# EAGLE design Qwiic_Shield_for_Photon (EAGLE 7.7.0)
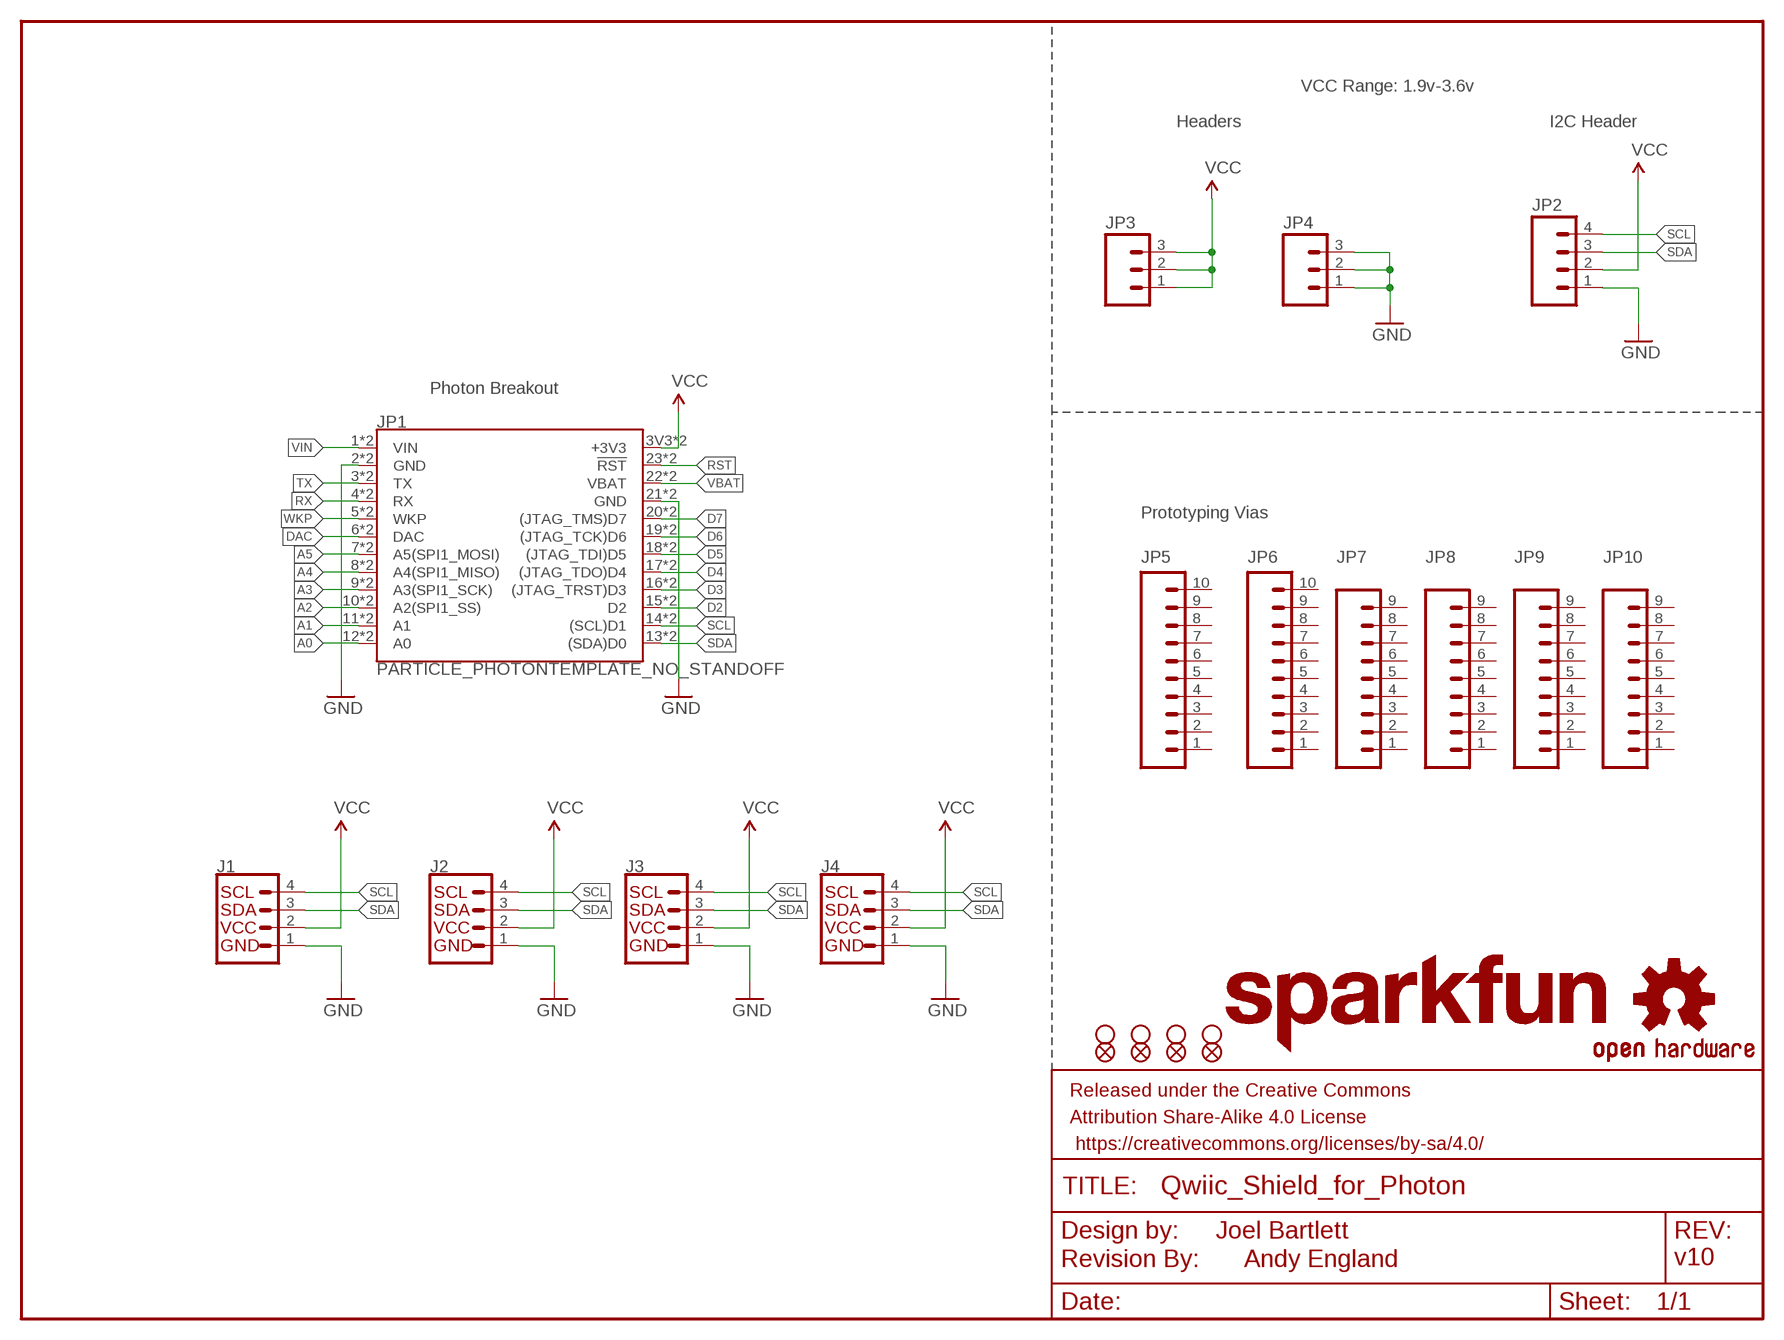
[diagram p0: schematic, sheet 1]

## Parts
FD1  FIDUCIALUFIDUCIAL  [FIDUCIAL-MICRO]
FD2  FIDUCIALUFIDUCIAL  [FIDUCIAL-MICRO]
FD3  FIDUCIALUFIDUCIAL  [FIDUCIAL-MICRO]
FD4  FIDUCIALUFIDUCIAL  [FIDUCIAL-MICRO]
FRAME1  FRAME-LETTER  [CREATIVE_COMMONS]
H1  STAND-OFF  [STAND-OFF]
H2  STAND-OFF  [STAND-OFF]
H3  STAND-OFF  [STAND-OFF]
H4  STAND-OFF  [STAND-OFF]
J1  QWIIC_CONNECTORJS-1MM  [1X04_1MM_RA]
J2  QWIIC_CONNECTORJS-1MM  [1X04_1MM_RA]
J3  QWIIC_CONNECTORJS-1MM  [1X04_1MM_RA]
J4  I2C_STANDARDJS-1MM  [1X04_1MM_RA]
JP1  PARTICLE_PHOTONTEMPLATE_NO_STANDOFF  [PARTICLE_PHOTON_TEMPLATE_NO_STANDOFF]
JP2  M04PTH  [1X04]
JP3  M03PTH  [1X03]
JP4  M03PTH  [1X03]
JP5  M10NO_SILK_PTH_FEMALE  [1X10_NO_SILK]
JP6  M10NO_SILK_PTH_FEMALE  [1X10_NO_SILK]
JP7  M09NO_SILK  [1X09_NO_SILK]
JP8  M09NO_SILK  [1X09_NO_SILK]
JP9  M09NO_SILK  [1X09_NO_SILK]
JP10  M09NO_SILK  [1X09_NO_SILK]
LOGO1  OSHW-LOGOM  [OSHW-LOGO-M]
LOGO2  REVISION  [REVISION]
U$4  SFE_LOGO_NAME.1_INCH  [SFE_LOGO_NAME_.1]

## Nets
A0: JP1.12(A0) JP1.A0
A1: JP1.11(A1) JP1.A1
A2: JP1.10(A2(SPI1_SS)) JP1.A2(A2(SPI1_SS))
A3: JP1.9(A3(SPI1_SCK)) JP1.A3(A3(SPI1_SCK))
A4: JP1.8(A4(SPI1_MISO)) JP1.A4(A4(SPI1_MISO))
A5: JP1.7(A5(SPI1_MOSI)) JP1.A5(A5(SPI1_MOSI))
D2: JP1.15(D2) JP1.D2
D3: JP1.16((JTAG_TRST)D3) JP1.D3((JTAG_TRST)D3)
D4: JP1.17((JTAG_TDO)D4) JP1.D4((JTAG_TDO)D4)
D5: JP1.18((JTAG_TDI)D5) JP1.D5((JTAG_TDI)D5)
D6: JP1.19((JTAG_TCK)D6) JP1.D6((JTAG_TCK)D6)
D7: JP1.20((JTAG_TMS)D7) JP1.D7((JTAG_TMS)D7)
DAC: JP1.6(DAC) JP1.DAC
GND: J1.1(GND) J2.1(GND) J3.1(GND) J4.1(GND) JP1.2(GND) JP1.21(GND) JP1.GND@0(GND) JP1.GND@2(GND) JP2.1 JP4.1 JP4.2 JP4.3
RST: JP1.23(!RST!) JP1.RST(!RST!)
RX: JP1.4(RX) JP1.RX
SCL: J1.4(SCL) J2.4(SCL) J3.4(SCL) J4.4(SCL) JP1.14((SCL)D1) JP1.D1((SCL)D1) JP2.4
SDA: J1.3(SDA) J2.3(SDA) J3.3(SDA) J4.3(SDA) JP1.13((SDA)D0) JP1.D0((SDA)D0) JP2.3
TX: JP1.3(TX) JP1.TX
VBAT: JP1.22(VBAT) JP1.VBAT
VCC: J1.2(VCC) J2.2(VCC) J3.2(VCC) J4.2(VCC) JP1.3V3(+3V3) JP1.24(+3V3) JP2.2 JP3.1 JP3.2 JP3.3
VIN: JP1.1(VIN) JP1.VIN
WKP: JP1.5(WKP) JP1.WKP
Unconnected: JP5.1 JP5.2 JP5.3 JP5.4 JP5.5 JP5.6 JP5.7 JP5.8 JP5.9 JP5.10 JP6.1 JP6.2 JP6.3 JP6.4 JP6.5 JP6.6 JP6.7 JP6.8 JP6.9 JP6.10 JP7.1 JP7.2 JP7.3 JP7.4 JP7.5 JP7.6 JP7.7 JP7.8 JP7.9 JP8.1 JP8.2 JP8.3 JP8.4 JP8.5 JP8.6 JP8.7 JP8.8 JP8.9 JP9.1 JP9.2 JP9.3 JP9.4 JP9.5 JP9.6 JP9.7 JP9.8 JP9.9 JP10.1 JP10.2 JP10.3 JP10.4 JP10.5 JP10.6 JP10.7 JP10.8 JP10.9

## Notes on the sheet
- VCC Range: 1.9v-3.6v
- Headers | I2C Header
- Photon Breakout
- Prototyping Vias
- Joel Bartlett
- Andy England | v10

## Library data of the parts
FD1-FD4 = SparkFun-Aesthetics:FIDUCIAL: Fiducial Alignment Points Point-of-reference for pick-and-place machines and other optical instruments.
FRAME1 = SparkFun-Aesthetics:FRAME-LETTER: Schematic Frame - Letter Standard 8.5x11 US Letter frame
H1-H4 = SparkFun-Hardware:STAND-OFF: Stand Off Drill holes for mechanically mounting via screws, standoffs, etc. Note: Use the keepout ring to avoid running the screw head into surrounding components. Variant Overviews STAND-OFF - Mechanical footprint for a #4 phillips button head screw. STAND-OFF-TIGHT - Mechanical footprint for a #4 phillips button head screw, Example SparkFun Products Screw - Phillips Head (1/4", 4-40, 10 pack) <https://www.sparkfun.com/products/10453> (PRT-10453) Screw - Phillips Head (1/2", 4-40, 10 pack) <https://www.sparkfun.com/products/10452> (PRT-10452) Screw - Phillips Head (3/4", 4-40, 10 pack) <https://www.sparkfun.com/products/10451> (PRT-10451) Screw - Phillips Head (1", 4-40, 10 pack) <https://www.sparkfun.com/products/10450> (PRT-10450)
J1-J3 = SparkFun-Connectors:QWIIC_CONNECTOR: SparkFun I2C Standard Qwiic Connector An SMD 1mm pitch JST connector makes it easy and quick (get it? Qwiic?) to connect I2C devices to each other. The Qwiic system <http://www.sparkfun.com/qwiic> enables fast and solderless connection between popular platforms and various sensors and actuators. We carry 200mm <https://www.sparkfun.com/products/14204>, 100mm <https://www.sparkfun.com/products/14205>, 50mm <https://www.sparkfun.com/products/14206>, and breadboard friendly <https://www.sparkfun.com/products/14207> Qwiic cables. We also offer 10 pcs strips <https://www.sparkfun.com/products/14323> the SMD connectors.; PROD_ID: CONN-13694
J4 = SparkX:I2C_STANDARD: SparkFun I2C Standard Pinout Header SparkFun has standardized on a pinout for all I2C based sensor breakouts. This pinout allows I2C boards to be plugged directly into the headers on Arduino Uno compatible boards, and to be daisy chained easily. Example SparkFun Products: SparkFun Atmospheric Sensor Breakout - BME280 <https://www.sparkfun.com/products/13676> SparkFun Altitude/Pressure Sensor Breakout - MPL3115A2 <https://www.sparkfun.com/products/11084> SparkFun TOF Range Finder Sensor - VL6180 <https://www.sparkfun.com/products/12785>
JP1 = SparkFun-Boards:PARTICLE_PHOTON: Particle Photon Footprint of the Particle Photon that is used as a basis for many Photon shields. SparkFun Products: Particle Photon <https://www.sparkfun.com/products/13764> SparkFun Photon ProtoShield <https://www.sparkfun.com/products/13598> SparkFun Photon micro OLED Shield <https://www.sparkfun.com/products/13628> SparkFun Photon IMU Shield <https://www.sparkfun.com/products/13629> SparkFun Photon Battery Shield <https://www.sparkfun.com/products/13626>
JP2 = SparkFun-Connectors:M04: Header 4 Standard 4-pin 0.1" header. Use with straight break away headers (SKU : PRT-00116), right angle break away headers (PRT-00553), swiss pins (PRT-00743), machine pins (PRT-00117), and female headers (PRT-00115). Molex polarized connector foot print use with SKU : PRT-08231 with associated crimp pins and housings. 1MM SMD Version SKU: PRT-10208
JP3 JP4 = SparkFun-Connectors:M03: Header 3 Standard 3-pin 0.1" header. Use with straight break away headers (SKU : PRT-00116), right angle break away headers (PRT-00553), swiss pins (PRT-00743), machine pins (PRT-00117), and female headers (PRT-00115). Molex polarized connector foot print use with SKU : PRT-08232 with associated crimp pins and housings.
JP5 JP6 = SparkFun-Connectors:M10: Header 10 Standard 10-pin 0.1" header. Use with straight break away headers (SKU : PRT-00116), right angle break away headers (PRT-00553), swiss pins (PRT-00743), machine pins (PRT-00117), and female headers (PRT-00115).; PROD_ID: CONN-11563
JP7-JP10 = SparkFun-Connectors:M09: Header 9 Standard 9-pin 0.1" header. Use with straight break away headers (SKU : PRT-00116), right angle break away headers (PRT-00553), swiss pins (PRT-00743), machine pins (PRT-00117), and female headers (PRT-00115).
LOGO1 = SparkFun-Aesthetics:OSHW-LOGO: Open-Source Hardware (OSHW) Logo This logo indicates the piece of hardware it is found on incorporates a OSHW license and/or adheres to the definition of open source hardware found here: http://freedomdefined.org/OSHW
LOGO2 = SparkFun-Aesthetics:REVISION: "Revision By" Text Preceding text for revisor documentation. Includes schematic text on "symbols" layer, and board text on tDoc.
U$4 = SparkFun-Aesthetics:SFE_LOGO_NAME: SparkFun Font Logo This is the SparkFun name logo. The logo on the schematic will always be the same size; the package variant is the height of the flame part of the logo (or the height the flame would be, if it were drawn). Default layer for the logo on the board is tSilk.

## Board
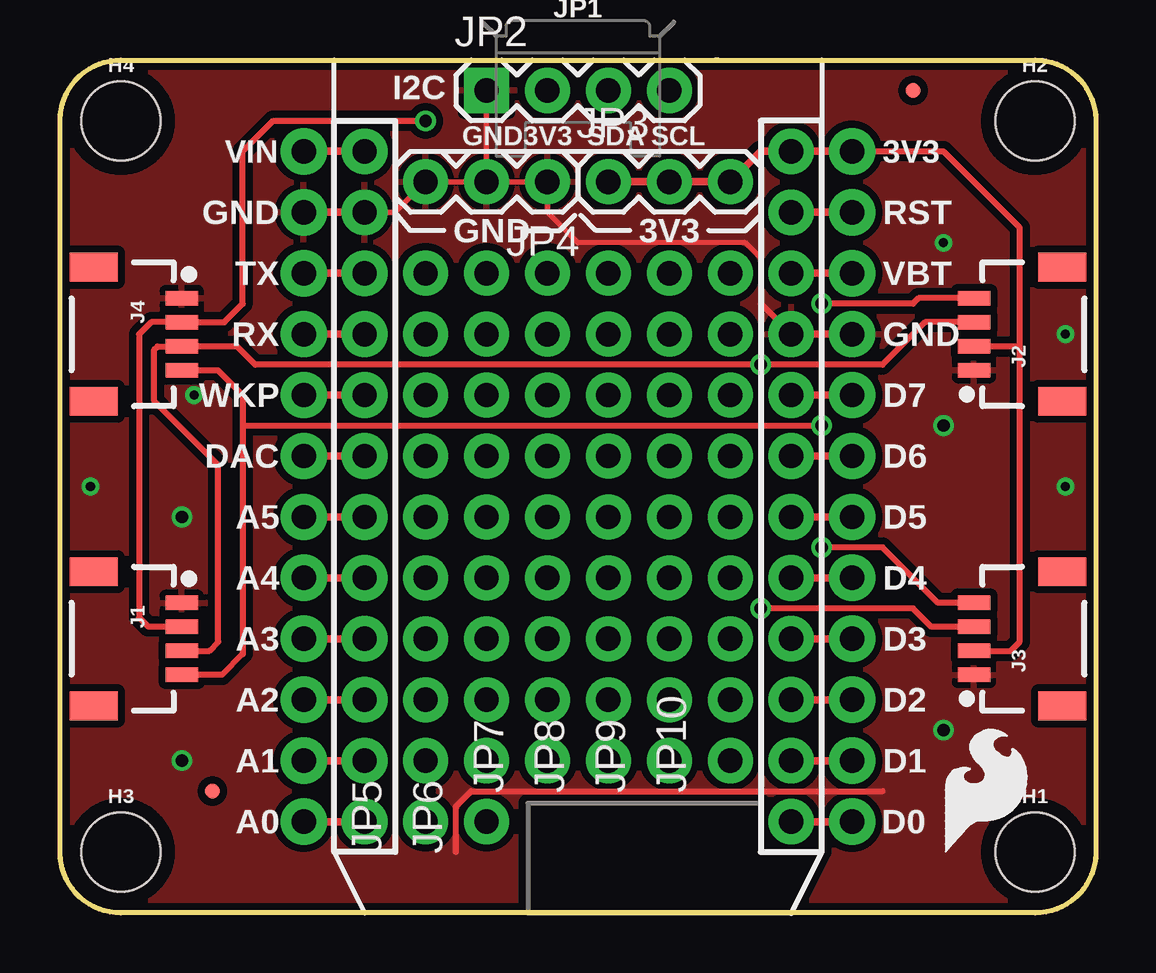
[diagram p1: board, top side]
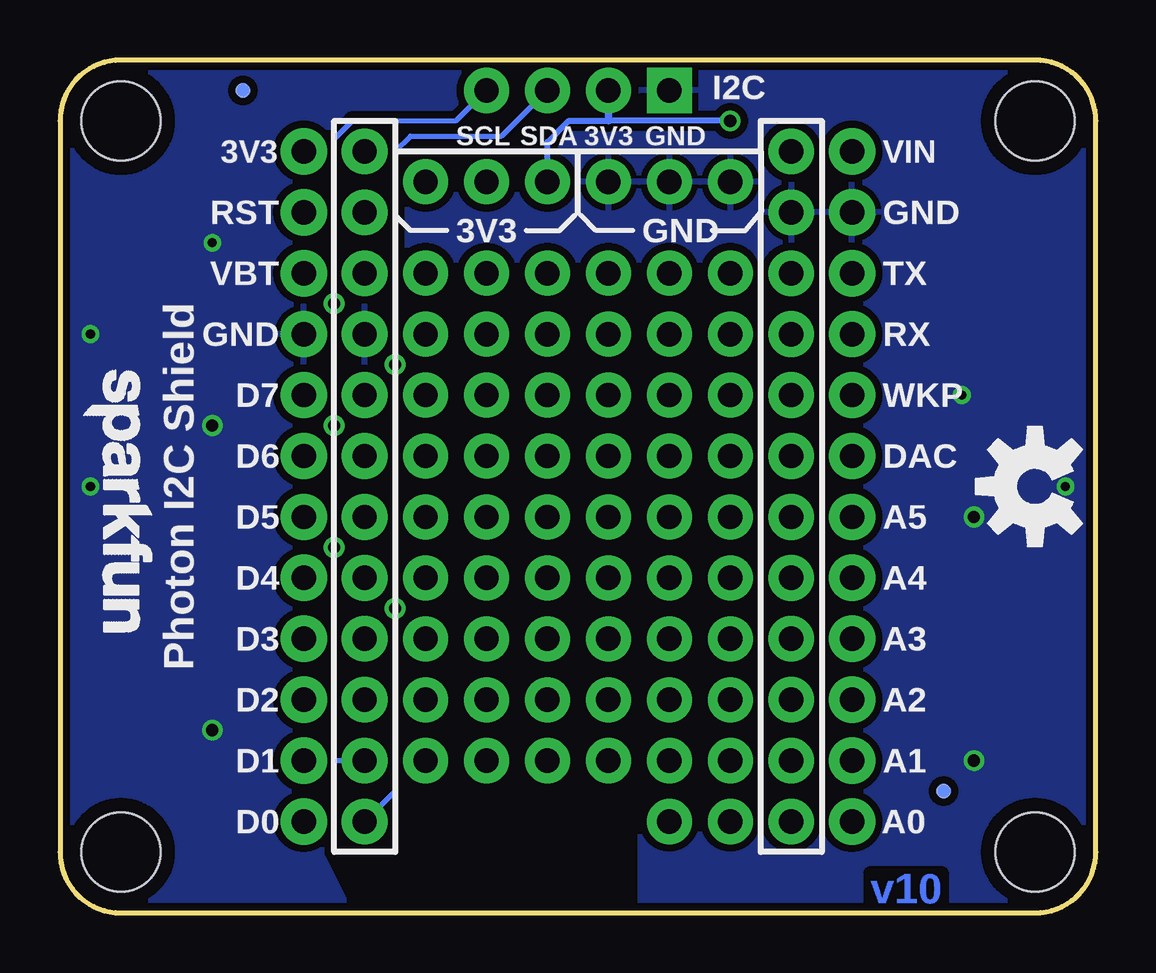
[diagram p2: board, bottom side, seen from below]

Size 43.18 x 35.56 mm. Coordinates in mm from the lower left corner, seen from the top.
Outline: 0,2.54 0,33.02 arc-90 2.54,35.56 40.64,35.56 arc-90 43.18,33.02 43.18,2.54 arc-90 40.64,0 2.54,0 arc-90 0,2.54
Copper layers (1*16): Top 0.035mm / dielectric 1.5mm / Bottom 0.035mm
Design rules "SparkFun-2-layer-TIGHT": minimum track width 7mil, minimum drill 15mil, track to track 7mil, track to pad 7mil, pad to pad 7mil, via to via 7mil, smd to smd 7mil, copper to edge 7mil, drill to drill 7mil, minimum pad ring 7mil, minimum via ring 7mil, stop-mask expansion 4mil, vias tented up to drill 25mil, thermal gap 10mil

### Footprints (pad centres in the part's own frame; a part is rotated, then mirrored left to right if it is on the bottom)
FIDUCIAL-MICRO = smd 0.635 x 0.635: 1 0,0
STAND-OFF = hole 3.302: 0,0
1X04_1MM_RA = smd 0.6 x 1.35: 1 -1.5,0; 2 -0.5,0; 3 0.5,0; 4 1.5,0 | smd 1.2 x 2: NC1 2.8,-3.675; NC2 -2.8,-3.675
PARTICLE_PHOTON_TEMPLATE_NO_STANDOFF = drill 1.016 pad 1.905: 1 -8.89,12.7; 2 -8.89,10.16; 3 -8.89,7.62; 4 -8.89,5.08; 5 -8.89,2.54; 6 -8.89,0; 7 -8.89,-2.54; 8 -8.89,-5.08; 9 -8.89,-7.62; 10 -8.89,-10.16; 11 -8.89,-12.7; 12 -8.89,-15.24; 13 8.89,-15.24; 14 8.89,-12.7; 15 8.89,-10.16; 16 8.89,-7.62; 17 8.89,-5.08; 18 8.89,-2.54; 19 8.89,0; 20 8.89,2.54; 21 8.89,5.08; 22 8.89,7.62; 23 8.89,10.16; 24 8.89,12.7 | drill 1.016 pad 1.93: 3V3 11.43,12.7; A0 -11.43,-15.24; A1 -11.43,-12.7; A2 -11.43,-10.16; A3 -11.43,-7.62; A4 -11.43,-5.08; A5 -11.43,-2.54; D0 11.43,-15.24; D1 11.43,-12.7; D2 11.43,-10.16; D3 11.43,-7.62; D4 11.43,-5.08; D5 11.43,-2.54; D6 11.43,0; D7 11.43,2.54; DAC -11.43,0; GND@0 -11.43,10.16; GND@2 11.43,5.08; RST 11.43,10.16; RX -11.43,5.08; TX -11.43,7.62; VBAT 11.43,7.62; VIN -11.43,12.7; WKP -11.43,2.54
1X04 = drill 1.016 pad 1.88 square: 1 0,0 | drill 1.016 pad 1.88: 2 2.54,0; 3 5.08,0; 4 7.62,0
1X03 = drill 1.016 pad 1.88: 1 0,0; 2 2.54,0; 3 5.08,0
1X10_NO_SILK = drill 1.016 pad 1.88: 1 0,0; 2 2.54,0; 3 5.08,0; 4 7.62,0; 5 10.16,0; 6 12.7,0; 7 15.24,0; 8 17.78,0; 9 20.32,0; 10 22.86,0
1X09_NO_SILK = drill 1.016 pad 1.88: 1 0,0; 2 2.54,0; 3 5.08,0; 4 7.62,0; 5 10.16,0; 6 12.7,0; 7 15.24,0; 8 17.78,0; 9 20.32,0

### Placement (x,y rotation side)
FD1  6.35,5.08 0 top
FD2  6.35,5.08 0 bottom
FD3  35.56,34.29 0 top
FD4  35.56,34.29 0 bottom
FRAME1  -11.43,-20.32 0 top  (outside the outline)
H1  40.64,2.54 0 top
H2  40.64,33.02 0 top
H3  2.54,2.54 0 top
H4  2.54,33.02 0 top
J1  5.08,11.43 270 top
J2  38.1,24.13 90 top
J3  38.1,11.43 90 top
J4  5.08,24.13 270 top
JP1  21.59,19.05 0 top
JP2  17.78,34.29 0 top
JP3  22.86,30.48 0 top
JP4  20.32,30.48 180 top
JP5  15.24,3.81 90 top
JP6  17.78,3.81 90 top
JP7  20.32,6.35 90 top
JP8  22.86,6.35 90 top
JP9  25.4,6.35 90 top
JP10  27.94,6.35 90 top
LOGO1  2.54,17.78 90 bottom
LOGO2  0,-22.86 0 top  (outside the outline)
U$1  [SFE_LOGO_FLAME_.2]  36.58,2.29 0 top
U$4  42.67,23.11 270 bottom

### Tracks (layer width: path | path; a pad name or v marks a point on that pad's centre or on a via)
GND  (via drill 0.38, 0.51)
  Top 0.203: JP1.2 13.97,29.21 JP4.3 JP4.2 | JP4.2 JP4.1 20.32,29.21 21.59,27.94 28.57,27.94 29.21,27.3 29.21,25.4 | JP4.2 JP2.1
  Top 0.254: 29.21,25.4 JP1.21 | 16.51,2.54 16.51,4.45 17.14,5.08 34.29,5.08
  other vias: 36.83,20.32 36.83,7.62 5.08,16.51 5.08,6.35 36.83,27.94 41.91,17.78 41.91,24.13 5.59,21.59 1.27,17.78
  pour Top (isolate 0.305): 0,35.56 0,0 43.18,0 43.18,35.56
  pour Bottom (isolate 0.305): 0,35.56 0,0 43.18,0 43.18,35.56
SCL  (via drill 0.51)
  Top 0.254: J3.4 36.6,12.93 34.29,15.24 v31.75,15.24 | J2.4 35.79,25.63 35.56,25.4 v31.75,25.4 | J4.4 6.58,22.63 7.62,21.59 7.62,20.32 | 7.62,20.32 7.62,10.79 6.75,9.93 J1.4 | 7.62,20.32 v31.75,20.32
  Bottom 0.203: v31.75,20.32 v31.75,15.24 31.75,6.35 JP1.14 | v31.75,25.4 31.75,32.26 30.99,33.02 26.67,33.02 JP2.4
  Bottom 0.254: v31.75,20.32 v31.75,25.4
SDA  (via drill 0.51)
  Top 0.254: J3.3 36.33,11.93 35.56,12.7 v29.21,12.7 | J2.3 36.06,24.63 34.29,22.86 v29.21,22.86 8.14,22.86 7.37,23.63 J4.3 4.06,23.62 3.94,23.5 3.94,21.34 6.6,18.67 6.6,11.3 6.23,10.93 J1.3
  Bottom 0.203: JP1.13 29.21,5.08 v29.21,12.7 v29.21,22.86 29.21,31.75 28.57,32.38 24.77,32.38 JP2.3
VCC  (via drill 0.51)
  Top 0.254: J3.2 39.63,10.93 40.01,11.3 40.01,23.62 | 40.01,23.62 40.01,28.57 36.83,31.75 JP1.3V3 | 40.01,23.62 J2.2 | J1.2 arc90 J1.2 3.68,11.94 3.3,12.32 3.3,24.13 3.8,24.63 J4.2 6.85,24.63 7.62,25.4 7.62,31.75 8.89,33.02 v15.24,33.02
  Top 0.305: JP1.24 29.21,31.75 JP3.3 JP3.2 JP3.1
  Bottom 0.254: v15.24,33.02 20.32,33.02 21.98,33.02 22.86,32.14 JP3.1
  Bottom 0.305: 20.32,33.02 JP2.2

### Text on the board
Bottom: v10
tPlace: I2C | GND | 3V3 | SDA | SCL | GND | 3V3
bPlace: I2C | GND | 3V3 | SDA | SCL | GND | 3V3 | Photon I2C Shield
Measures: Units in Inches
tDocu: Joel Bartlett | Andy England